# EAGLE schematic brick_i2c_temperature (EAGLE 7.4.0)
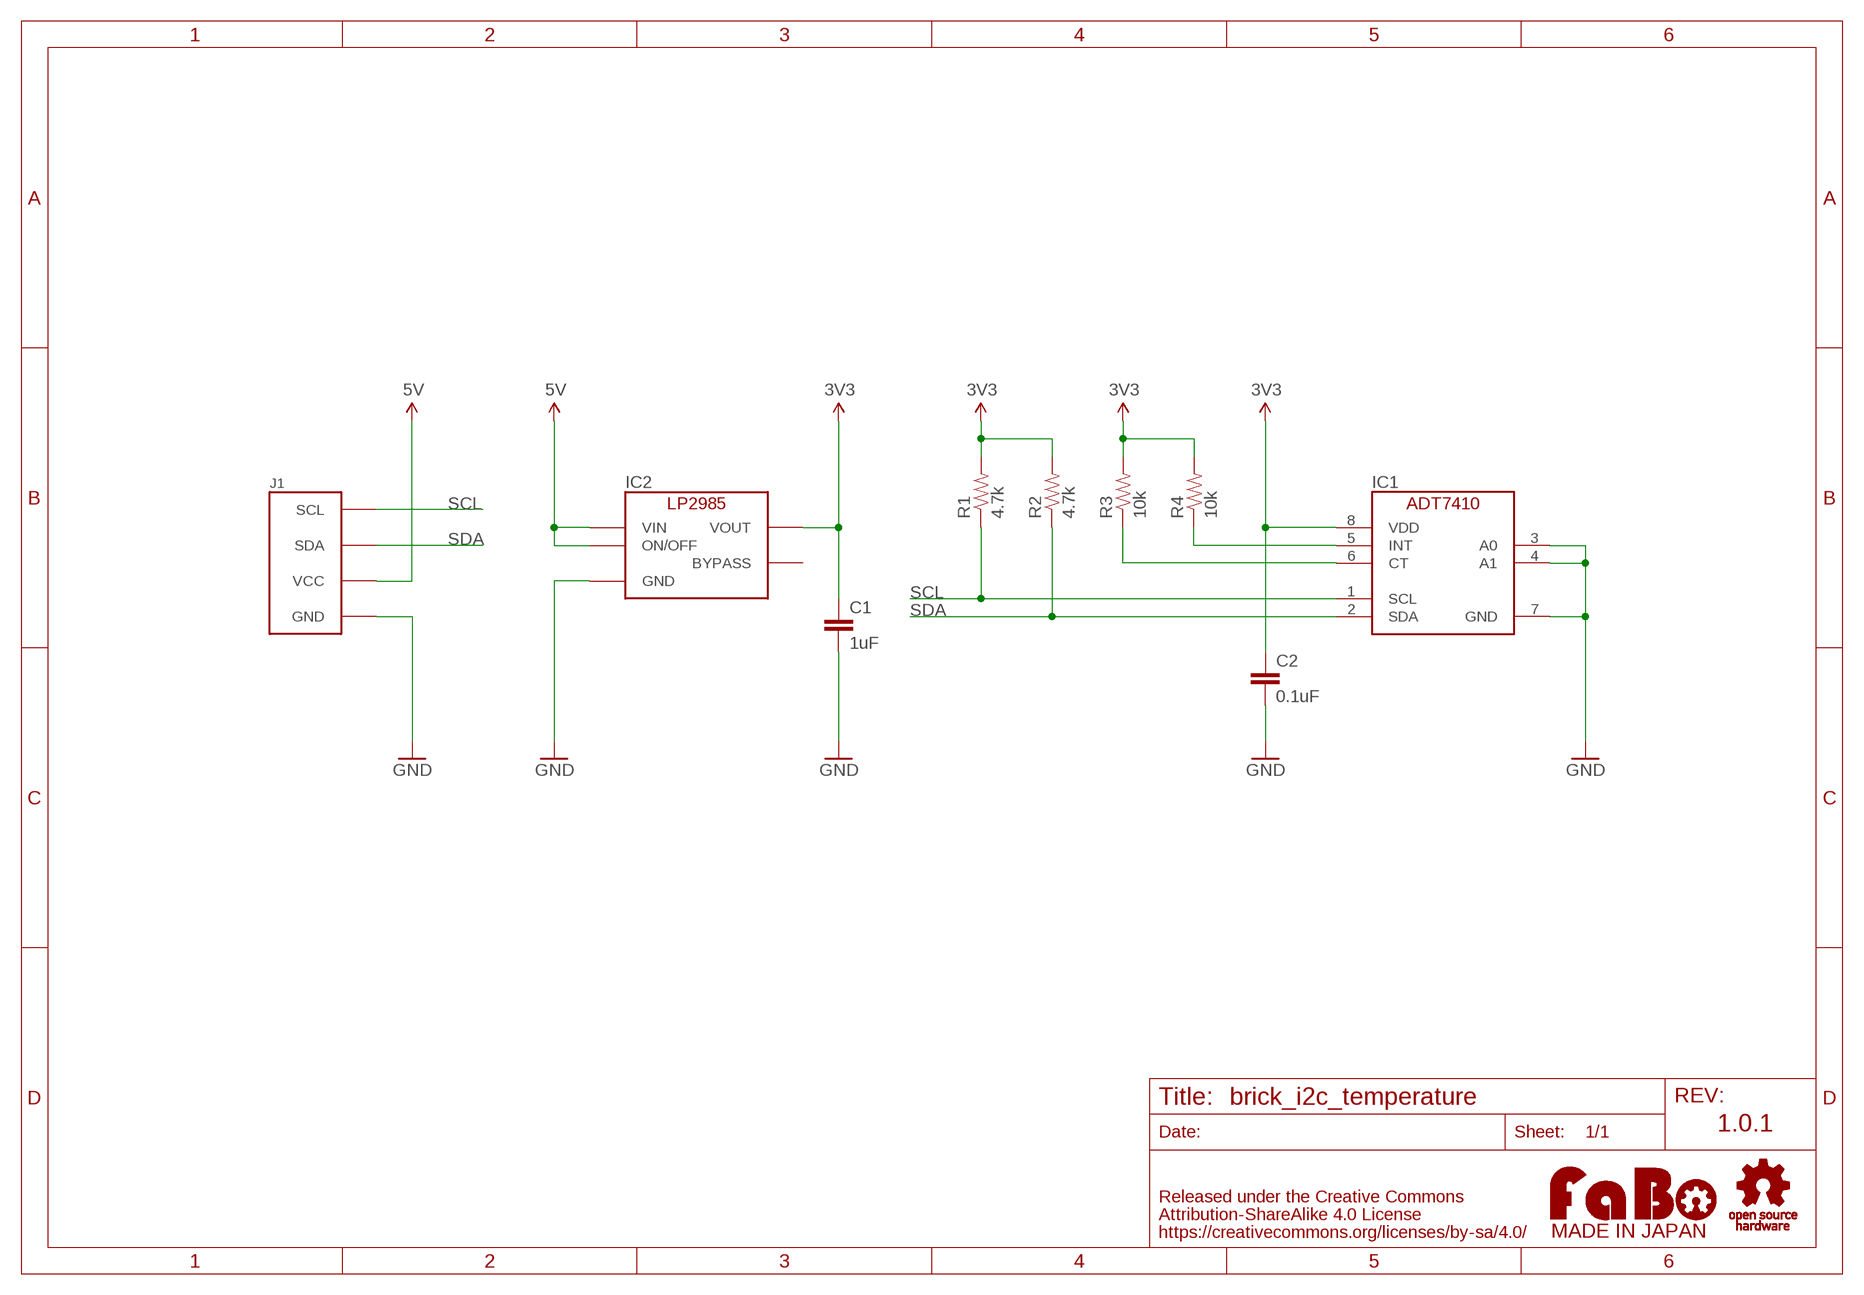
[diagram p0: schematic, sheet 1]

## Parts
C1  1uF  CAP-EIA0603  [EIA0603]
C2  0.1uF  CAP-EIA0603  [EIA0603]
IC1  ANALOGDEVICES-ADT7410  [ADT7410]
IC2  TI-LP2985-33DBVR  [TI-LP2985]
J1  FABO_BRICK_I2C  [FABO_BRICK_I2C]
R1  4.7k  RES-EIA0603  [EIA0603]
R2  4.7k  RES-EIA0603  [EIA0603]
R3  10k  RES-EIA0603  [EIA0603]
R4  10k  RES-EIA0603  [EIA0603]
U$1  LOGO_OSHW-T_M  [LOGO_OSHW_T_M]
U$3  LOGO_FABO-M  [LOGO_FABO_M]

## Nets
3V3: C1.1 C2.1 IC1.8(VDD) IC2.5(VOUT) R1.2 R2.2 R3.2 R4.2
5V: IC2.1(VIN) IC2.3(ON/OFF) J1.VCC
GND: C1.2 C2.2 IC1.3(A0) IC1.4(A1) IC1.7(GND) IC2.2(GND) J1.GND
N$1: IC1.6(CT) R3.1
N$2: IC1.5(INT) R4.1
SCL: IC1.1(SCL) J1.SCL R1.1
SDA: IC1.2(SDA) J1.SDA R2.1
Unconnected: IC2.4(BYPASS)

## Notes on the sheet
- 1.0.1

## Library data of the parts
C1 C2 = FaBo-etc:CAP: Capacitor Standard 0603 ceramic capacitor
IC1 = FaBo-Sensor:ANALOGDEVICES-ADT7410
IC2 = FaBo-Supply:TI-LP2985: LP2985
J1 = FaBo-Template:FABO_BRICK_I2C: FaBo Brick I2C
R1-R4 = FaBo-etc:RES
U$1 = FaBo-etc:LOGO_OSHW
U$3 = FaBo-etc:LOGO_FABO